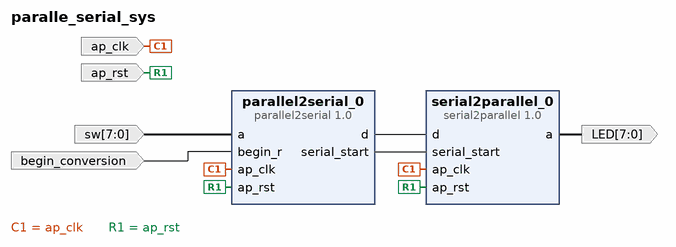
[diagram p0: block diagram of the top level]
# Vivado block design paralle_serial_sys, xc7a35tcpg236-1, Vivado 2025.1
create_bd_design paralle_serial_sys

create_bd_port -dir I -from 7 -to 0 -type data sw
create_bd_port -dir I -type clk ap_clk
create_bd_port -dir I -type rst ap_rst
set_property -dict {CONFIG.POLARITY ACTIVE_HIGH} [get_bd_ports ap_rst]
create_bd_port -dir I -type data begin_conversion
create_bd_port -dir O -from 7 -to 0 -type data LED

create_bd_cell -type ip -vlnv xilinx.com:hls:serial2parallel:1.0 serial2parallel_0
create_bd_cell -type ip -vlnv xilinx.com:hls:parallel2serial:1.0 parallel2serial_0

# ---- connections ----

connect_bd_net -net a_0_1 [get_bd_ports sw] [get_bd_pins parallel2serial_0/a]
connect_bd_net -net ap_clk_0_1 [get_bd_ports ap_clk] [get_bd_pins parallel2serial_0/ap_clk] [get_bd_pins serial2parallel_0/ap_clk]
connect_bd_net -net ap_rst_0_1 [get_bd_ports ap_rst] [get_bd_pins parallel2serial_0/ap_rst] [get_bd_pins serial2parallel_0/ap_rst]
connect_bd_net -net begin_r_0_1 [get_bd_ports begin_conversion] [get_bd_pins parallel2serial_0/begin_r]
connect_bd_net [get_bd_pins parallel2serial_0/d] [get_bd_pins serial2parallel_0/d]
connect_bd_net [get_bd_pins parallel2serial_0/serial_start] [get_bd_pins serial2parallel_0/serial_start]
connect_bd_net [get_bd_pins serial2parallel_0/a] [get_bd_ports LED]

validate_bd_design
save_bd_design
